# EAGLE schematic Pwdr-Circuit-0.2 (EAGLE 6.3)
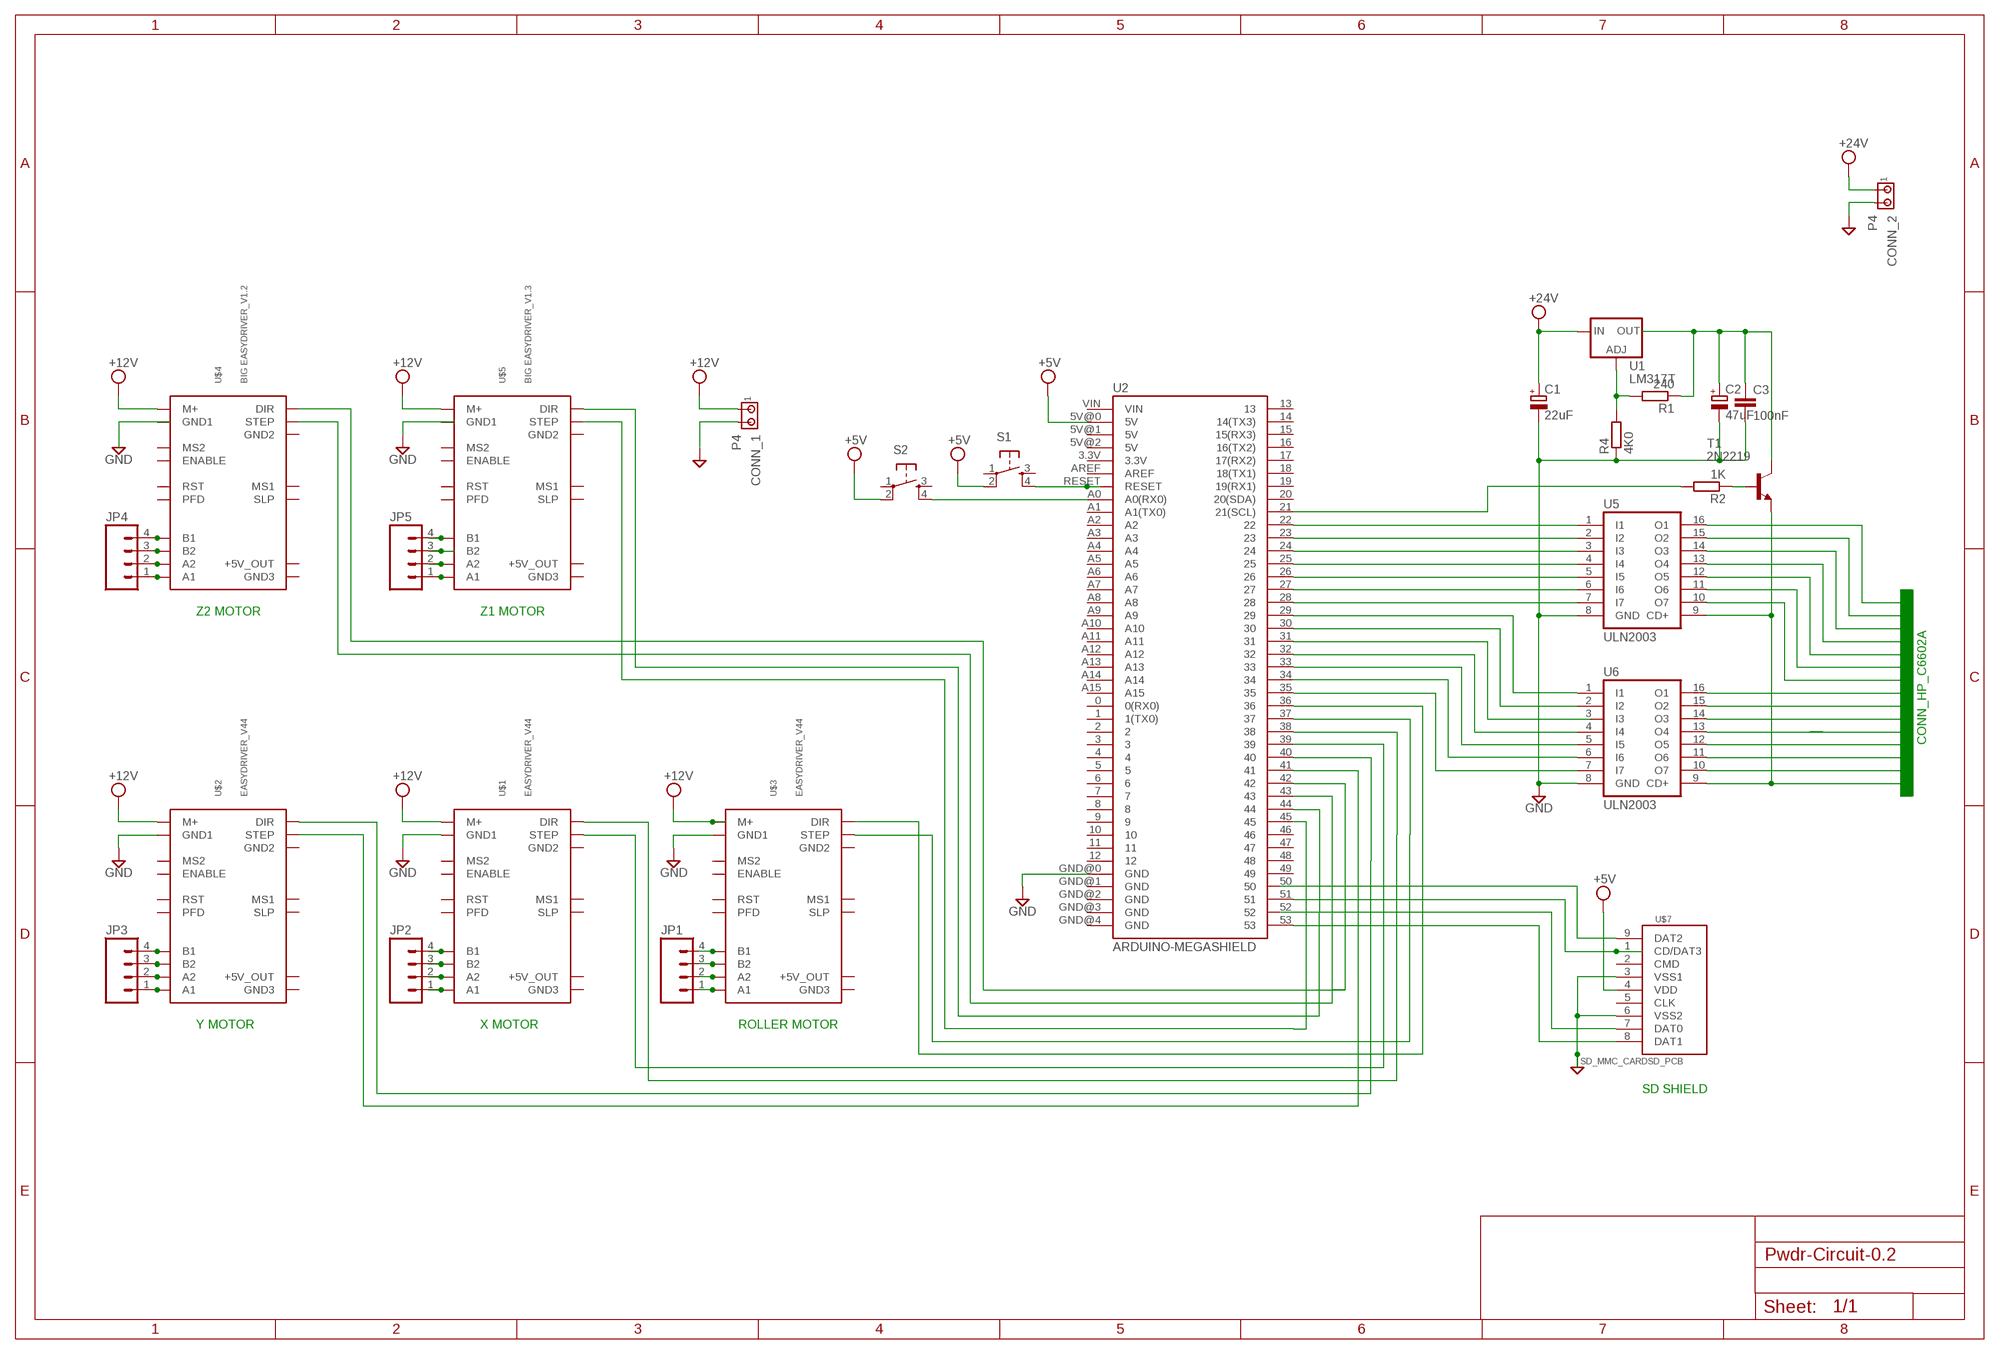
[diagram p0: schematic, sheet 1]

## Parts
C1  22uF  CPOL-EUE2.5-6  [E2,5-6]
C2  47uF  CPOL-EUE2.5-6  [E2,5-6]
C3  100nF  C-EU025-024X044  [C025-024X044]
CONN_1  P4  MTA02-156  [1X2MTA]
CONN_2  P4  MTA02-156  [1X2MTA]
JP1  M041X04_NO_SILK  [1X04_NO_SILK]
JP2  M041X04_NO_SILK  [1X04_NO_SILK]
JP3  M041X04_NO_SILK  [1X04_NO_SILK]
JP4  M041X04_NO_SILK  [1X04_NO_SILK]
JP5  M041X04_NO_SILK  [1X04_NO_SILK]
R1  240  R-EU_0204/2V  [0204V]
R2  1K  R-EU_0204/2V  [0204V]
R4  4K0  R-EU_0204/2V  [0204V]
S1  TAC_SWITCHSMD  [TACTILE_SWITCH_SMD]
S2  TAC_SWITCHSMD  [TACTILE_SWITCH_SMD]
T1  2N2219  [TO5]
U1  LM317T  LM317L  [317L]
U2  ARDUINO-MEGASHIELD  ARDUINO-MEGAFULL  [ARDUINO_MEGA]
U5  ULN2003  ULN2003AN  [DIL16]
U6  ULN2003  ULN2003AN  [DIL16]
U$1  EASYDRIVER_V44  [EASYDRIVER_V44]
U$2  EASYDRIVER_V44  [EASYDRIVER_V44]
U$3  EASYDRIVER_V44  [EASYDRIVER_V44]
U$4  BIG EASYDRIVER_V1.2  EASYDRIVER_V44  [EASYDRIVER_V44]
U$5  BIG EASYDRIVER_V1.3  EASYDRIVER_V44  [EASYDRIVER_V44]
U$7  SD_MMC_CARDSD_PCB  [SD-MMC-CARD]

## Nets
AGND: C1.- C2.- C3.2 CONN_1.2 CONN_2.2 R4.1 U2.GND@0(GND) U5.8(GND) U6.8(GND) U$1.GND1 U$2.GND1 U$3.GND1 U$4.GND1 U$5.GND1 U$7.3(VSS1) U$7.6(VSS2) ; supply symbol labelled GND
N$1: R1.2 R4.2 U1.1(ADJ)
N$2: C2.+ C3.1 R1.1 T1.3(C) U1.2(OUT)
N$3: U2.22 U5.1(I1)
N$4: U2.23 U5.2(I2)
N$5: U2.24 U5.3(I3)
N$6: U2.25 U5.4(I4)
N$7: U2.26 U5.5(I5)
N$8: U2.27 U5.6(I6)
N$9: U2.28 U5.7(I7)
N$10: U2.29 U6.1(I1)
N$11: U2.30 U6.2(I2)
N$12: U2.31 U6.3(I3)
N$13: U2.32 U6.4(I4)
N$14: U2.33 U6.5(I5)
N$15: U2.34 U6.6(I6)
N$16: U2.35 U6.7(I7)
N$17: U2.42 U$4.DIR
N$18: U2.36 U$3.DIR
N$19: U2.37 U$3.STEP
N$20: U2.38 U2.40 U$1.DIR U$2.DIR
N$21: U2.39 U$1.STEP
N$22: U2.44 U$5.DIR
N$23: U2.43 U$4.STEP
N$24: U2.41 U$2.STEP
N$25: U2.45 U$5.STEP
N$26: S1.4 U2.RESET
N$27: S2.4 U2.A0(A0(RX0))
N$28: U$7.9(DAT2)
N$29: T1.1(E) U5.9(CD+) U6.9(CD+)
N$30: JP1.4 U$3.B1
N$31: U2.53 U$7.8(DAT1)
N$32: JP1.3 U$3.B2
N$33: JP1.2 U$3.A2
N$34: JP1.1 U$3.A1
N$35: JP2.1 U$1.A1
N$36: JP2.2 U$1.A2
N$37: JP2.3 U$1.B2
N$38: JP2.4 U$1.B1
N$39: JP3.1 U$2.A1
N$40: JP3.2 U$2.A2
N$41: JP3.3 U$2.B2
N$42: JP3.4 U$2.B1
N$43: JP4.1 U$4.A1
N$44: JP4.2 U$4.A2
N$45: JP4.3 U$4.B2
N$46: JP4.4 U$4.B1
N$47: JP5.1 U$5.A1
N$48: JP5.2 U$5.A2
N$49: U$7.7(DAT0)
N$50: JP5.4 U$5.B1
N$51: JP5.3 U$5.B2
N$52: U5.16(O1)
N$53: U5.15(O2)
N$54: U5.14(O3)
N$55: U5.13(O4)
N$56: U5.12(O5)
N$57: U5.11(O6)
N$58: U5.10(O7)
N$59: U6.16(O1)
N$60: U6.15(O2)
N$61: U6.14(O3)
N$62: U6.13(O4)
N$63: U6.12(O5)
N$64: U6.11(O6)
N$65: U6.10(O7)
N$66: U2.51 U$7.1(CD/DAT3)
N$67: R2.2 U2.21(21(SCL))
N$68: R2.1 T1.2(B)
VCC: C1.+ CONN_1.1 CONN_2.1 S1.2 S2.2 U1.3(IN) U2.5V@0(5V) U$1.M+ U$2.M+ U$3.M+ U$4.M+ U$5.M+ U$7.4(VDD) ; supply symbol labelled +24V, +12V, +5V
Unconnected: S1.1 S1.3 S2.1 S2.3 U2.0(0(RX0)) U2.1(1(TX0)) U2.2 U2.3 U2.3.3V U2.4 U2.5 U2.5V@1(5V) U2.5V@2(5V) U2.6 U2.7 U2.8 U2.9 U2.10 U2.11 U2.12 U2.13 U2.14(14(TX3)) U2.15(15(RX3)) U2.16(16(TX2)) U2.17(17(RX2)) U2.18(18(TX1)) U2.19(19(RX1)) U2.20(20(SDA)) U2.46 U2.47 U2.48 U2.49 U2.50 U2.52 U2.A1(A1(TX0)) U2.A2 U2.A3 U2.A4 U2.A5 U2.A6 U2.A7 U2.A8 U2.A9 U2.A10 U2.A11 U2.A12 U2.A13 U2.A14 U2.A15 U2.AREF U2.GND@1(GND) U2.GND@2(GND) U2.GND@3(GND) U2.GND@4(GND) U2.VIN U$1.ENABLE U$1.GND2 U$1.GND3 U$1.MS1 U$1.MS2 U$1.P$11(+5V_OUT) U$1.PFD U$1.RST U$1.SLEEP(SLP) U$2.ENABLE U$2.GND2 U$2.GND3 U$2.MS1 U$2.MS2 U$2.P$11(+5V_OUT) U$2.PFD U$2.RST U$2.SLEEP(SLP) U$3.ENABLE U$3.GND2 U$3.GND3 U$3.MS1 U$3.MS2 U$3.P$11(+5V_OUT) U$3.PFD U$3.RST U$3.SLEEP(SLP) U$4.ENABLE U$4.GND2 U$4.GND3 U$4.MS1 U$4.MS2 U$4.P$11(+5V_OUT) U$4.PFD U$4.RST U$4.SLEEP(SLP) U$5.ENABLE U$5.GND2 U$5.GND3 U$5.MS1 U$5.MS2 U$5.P$11(+5V_OUT) U$5.PFD U$5.RST U$5.SLEEP(SLP) U$7.2(CMD) U$7.5(CLK)

## Notes on the sheet
- Z2 MOTOR | Z1 MOTOR
- CONN_HP_C6602A
- Y MOTOR | X MOTOR | ROLLER MOTOR
- SD SHIELD

## Library data of the parts
C1 C2 = rcl:CPOL-EU: POLARIZED CAPACITOR, European symbol
C3 = resistor:C-EU: CAPACITOR, European symbol
CONN_1 CONN_2 = con-amp:MTA02-156: AMP connector
JP1-JP5 = SparkFun:M04: Header 4 Standard 4-pin 0.1" header. Use with straight break away headers (SKU : PRT-00116), right angle break away headers (PRT-00553), swiss pins (PRT-00743), machine pins (PRT-00117), and female headers (PRT-00115). Molex polarized connector foot print use with SKU : PRT-08231 with associated crimp pins and housings. 1MM SMD Version SKU: PRT-10208
R1 R2 R4 = rcl:R-EU_: RESISTOR, European symbol
S1 S2 = SparkFun:TAC_SWITCH: Momentary Switch Button commonly used for reset or general input. Spark Fun Electronics SKU : COM-00097
T1 = transistor:2N2219: NPN TRANSISTOR
U1 = v-reg:LM317L: VOLTAGE REGULATOR
U2 = SparkFun:ARDUINO-MEGA: Arduino Mega footprint connections
U5 U6 = uln-udn:ULN2003A: DRIVER ARRAY
U$1-U$5 = EasyDriver:EASYDRIVER_V44: EasyDriver version 4.4 - http://www.schmalzhaus.com/EasyDriver
U$7 = SparkFun:SD_MMC_CARD